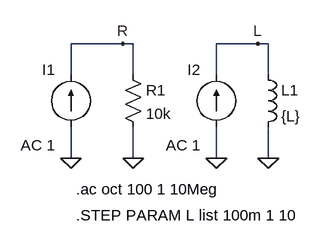
[diagram p0: schematic Fig_6-15_AC_Current-R-XL_sweep.asc]
Fig_6-15_AC_Current-R-XL_sweep.asc, the LTspice schematic file:
Version 4
SHEET 1 880 680
WIRE 176 96 96 96
WIRE 192 96 176 96
WIRE 384 96 320 96
WIRE 400 96 384 96
WIRE 96 144 96 96
WIRE 192 144 192 96
WIRE 320 144 320 96
WIRE 400 144 400 96
WIRE 96 272 96 224
WIRE 192 272 192 224
WIRE 320 272 320 224
WIRE 400 272 400 224
FLAG 400 272 0
FLAG 96 272 0
FLAG 320 272 0
FLAG 192 272 0
FLAG 176 96 R
FLAG 384 96 L
SYMBOL res 176 128 R0
SYMATTR InstName R1
SYMATTR Value 10k
SYMBOL current 96 224 R180
WINDOW 0 24 88 Left 2
WINDOW 3 24 0 Left 2
WINDOW 123 24 -28 Left 2
WINDOW 39 0 0 Left 2
SYMATTR InstName I1
SYMATTR Value ""
SYMATTR Value2 AC 1
SYMBOL ind 384 128 R0
SYMATTR InstName L1
SYMATTR Value {L}
SYMBOL current 320 224 R180
WINDOW 0 24 88 Left 2
WINDOW 3 24 0 Left 2
WINDOW 123 24 -28 Left 2
WINDOW 39 0 0 Left 2
SYMATTR InstName I2
SYMATTR Value ""
SYMATTR Value2 AC 1
TEXT 104 320 Left 2 !.ac oct 100 1 10Meg
TEXT 104 360 Left 2 !.STEP PARAM L list 100m 1 10

The netlist it stands for:
* Fig_6-15_AC_Current-R-XL_sweep.asc
R1 R 0 10k
I1 0 R AC 1
L1 L 0 {L}
I2 0 L AC 1
.ac oct 100 1 10Meg
.STEP PARAM L list 100m 1 10
.backanno
.end